# Altium schematic sheet Sensors.SchDoc: Sensor Array
size A4; Date: May 2021; Revision: 1.0; SheetNumber: 1; SheetTotal: 1
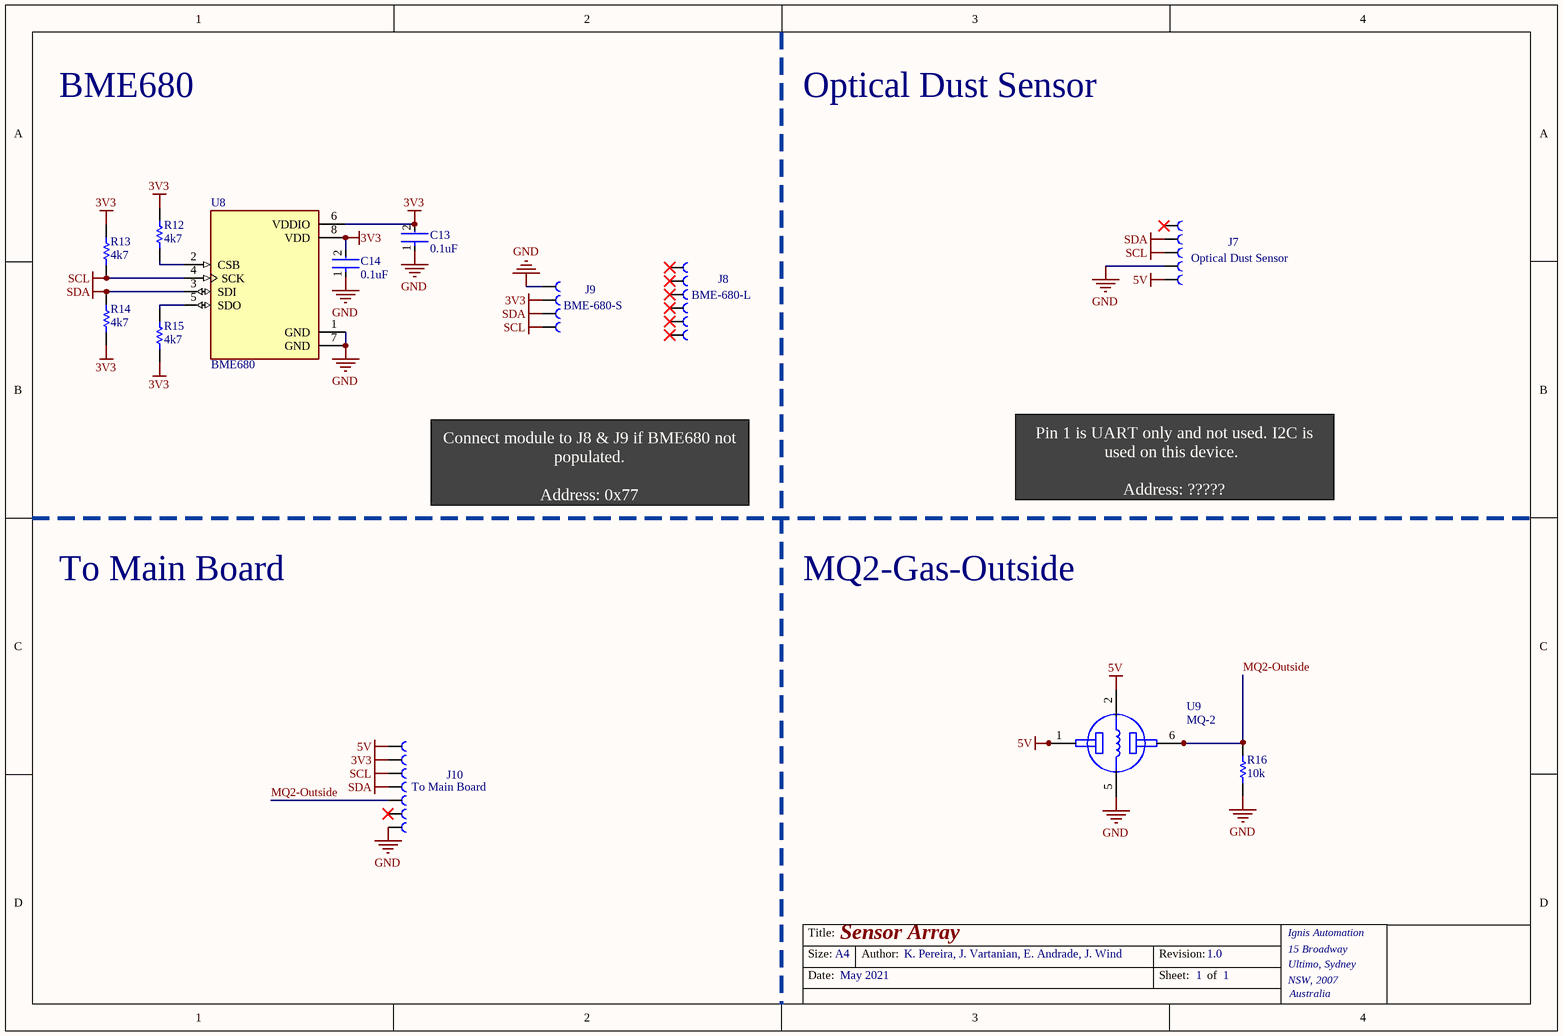
[diagram p0: Sensors.SchDoc]

## Parts
C13  0.1uF  [FP-CL10-IPC_C]
C14  0.1uF  [FP-CL10-IPC_C]
J7  Optical Dust Sensor  [61300711821]
J8  BME-680-L  [61300711821]
J9  BME-680-S  [61300711821]
J10  To Main Board  [61300711821]
R12  4k7  [RESC1608X55X30NL15T15]
R13  4k7  [RESC1608X55X30NL15T15]
R14  4k7  [RESC1608X55X30NL15T15]
R15  4k7  [RESC1608X55X30NL15T15]
R16  10k  [RESC1608X55X30NL15T15]
U8  BME680  [PSON80P300X300X100-8N]
U9  MQ-2  [XDCR_SEN-08880]

## Nets
3V3: C13.2 C14.2 J9.2 J10.2 R12.2 R13.2 R14.1 R15.1 U8.6(VDDIO) U8.8(VDD)
5V: J7.5 J10.1 U9.1(A) U9.2(H1) U9.3(A)
GND: C13.1 C14.1 J7.4 J9.1 J10.7 R16.1 U8.1(GND) U8.7(GND) U9.5(H2)
SCL: J7.3 J9.4 J10.3 R13.1 U8.4(SCK)
SDA: J7.2 J9.3 J10.4 R14.2 U8.3(SDI)
MQ2-Outside: J10.5 R16.2 U9.4(B) U9.6(B)
NetR12_1: R12.1 U8.2(CSB)
NetR15_2: R15.2 U8.5(SDO)

Not connected (* = marked no-connect by the designer): J7 1*; J8 1* 2* 3* 4* 5* 6*; J10 6*

## Notes on the sheet
- BME680
- Optical Dust Sensor
- Connect module to J8 & J9 if BME680 not populated.
  Address: 0x77
- Pin 1 is UART only and not used. I2C is used on this device.
  Address: ?????
- To Main Board
- MQ2-Gas-Outside
- Title:
- Size:
- Date:
- A4
- Author:
- K. Pereira, J. Vartanian, E. Andrade, J. Wind
- Revision:
- Sheet:
- of
- Ignis Automation
- 15 Broadway
- Ultimo, Sydney
- NSW, 2007
- Australia

## Library data of the parts
C13 = CMP-13271-003248-1: CAP CER 0.1UF 50V X7R 0603; Part Number: 1276-CL10B104KB8NNNLCT-NDT-ND
C14 = CMP-13271-003248-1: CAP CER 0.1UF 50V X7R 0603; Part Number: 1276-CL10B104KB8NNNLCT-ND
J7 = 61300711821: 5 Pin
J8 = 61300711821: 6 Pin
J9 = 61300711821: 4 Pin
J10 = 61300711821: 7 Pin
R12-R15 = CMP-2000-00180-1: RES SMD 4.7K OHM 1% 1/10W 0603; Part Number: 311-4.70KHRCT-ND
R16 = CMP-2000-00180-1: RES SMD 10K OHM 1% 1/10W 0603; Part Number: A121523CT-ND
U8 = BME680: SENSOR RH PRESSURE TEMP VOC; Part Number: 828-1077-1-ND
U9 = MQ-2: MQ-2 Gas Sensor